# EAGLE schematic Antenna Schematic (EAGLE 9.6.2)
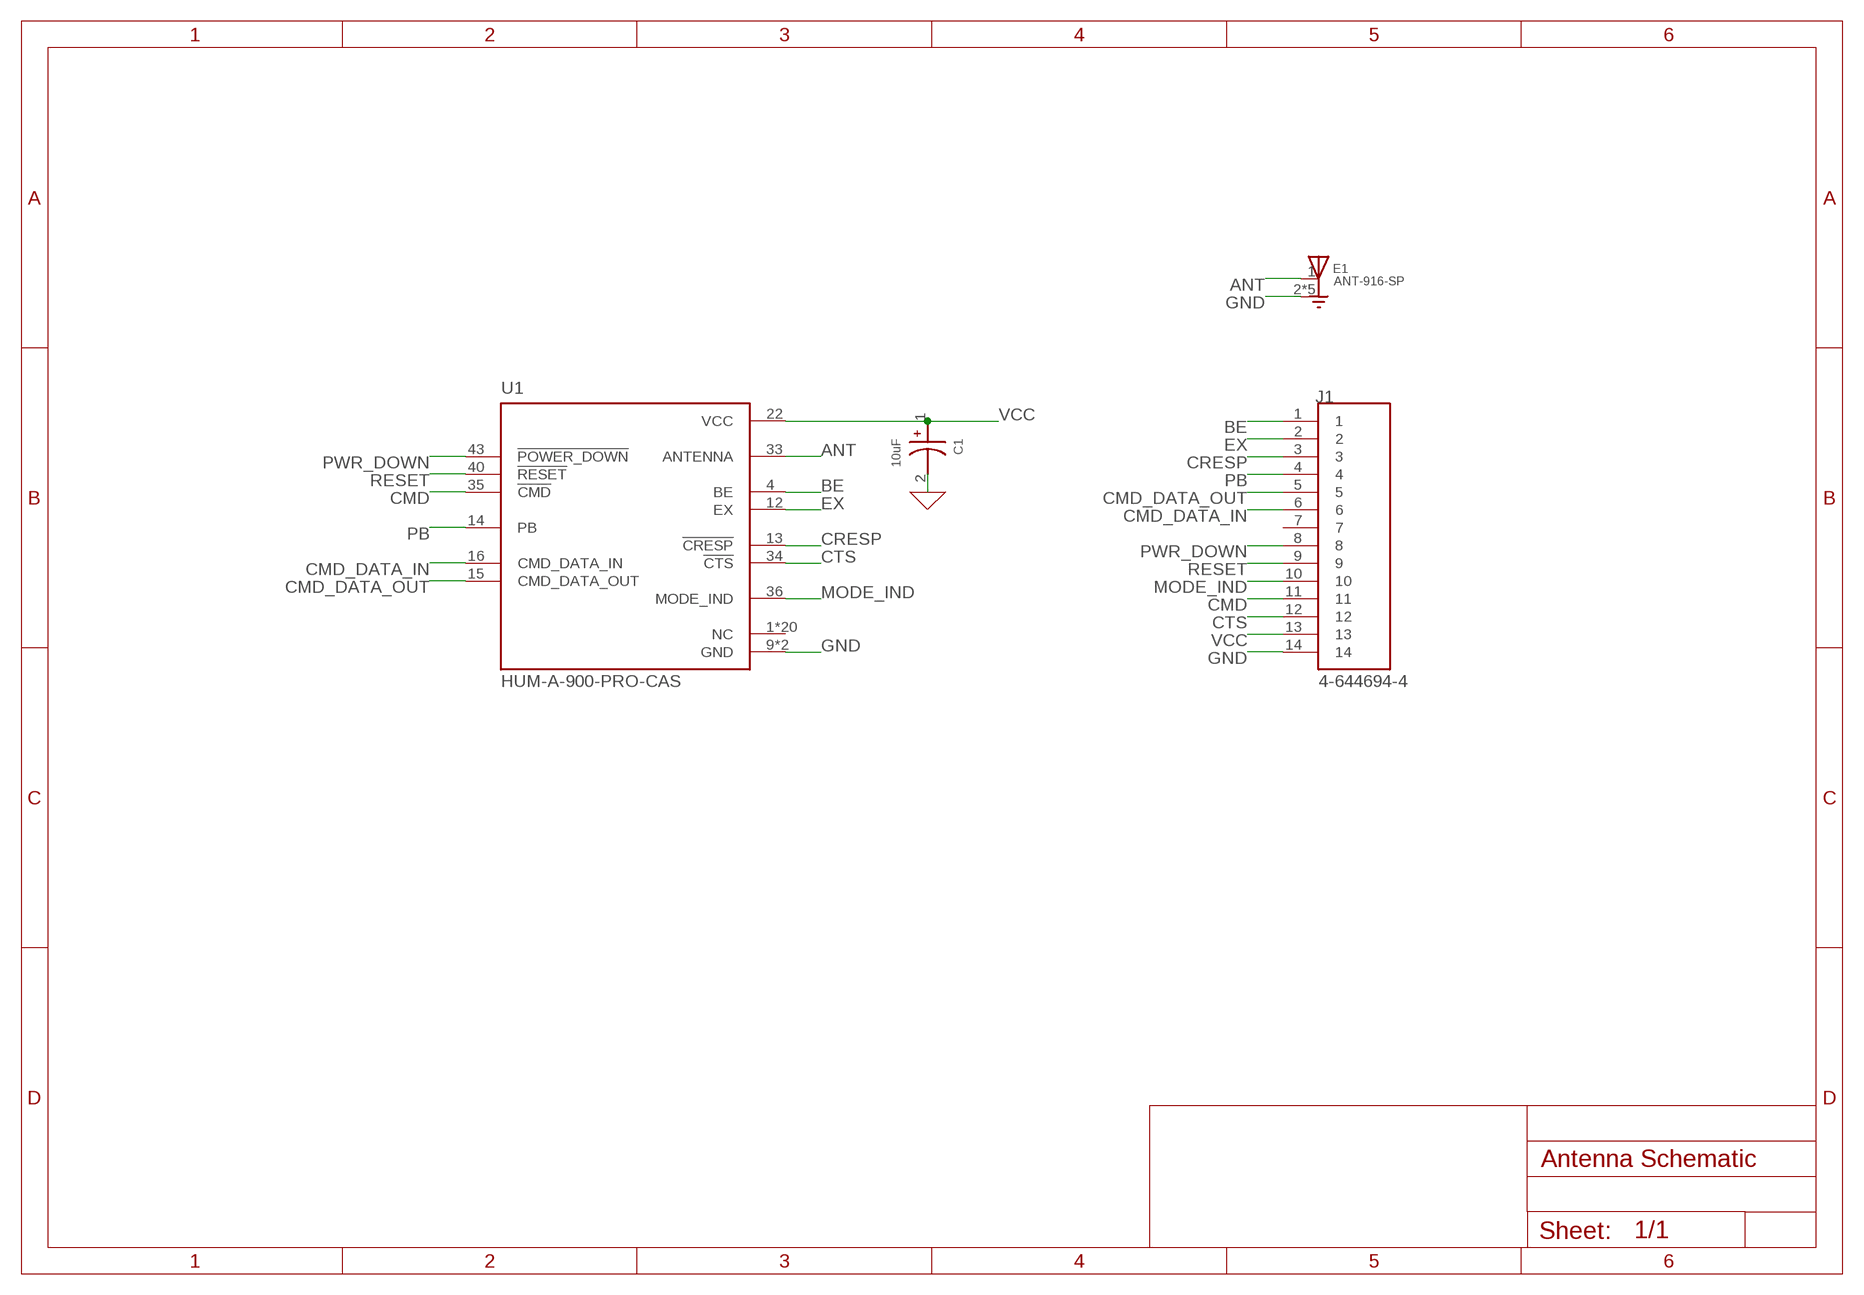
[diagram p0: schematic, sheet 1]

## Parts
C1  10uF  TAJA106K010RNJ  [CAPMP3216X180N]
E1  ANT-916-SP  [XDCR_ANT-916-SP]
J1  4-644694-4  [TE_4-644694-4]
U1  HUM-A-900-PRO-CAS  [XCVR_HUM-A-900-PRO-CAS]

## Nets
ANT: E1.1(FEEDING) U1.33(ANTENNA)
BE: J1.1 U1.4(BE)
CMD: J1.11 U1.35(!CMD)
CMD_DATA_IN: J1.6 U1.16(CMD_DATA_IN)
CMD_DATA_OUT: J1.5 U1.15(CMD_DATA_OUT)
CRESP: J1.3 U1.13(!CRESP)
CTS: J1.12 U1.34(!CTS)
EX: J1.2 U1.12(EX)
GND: C1.2 E1.2(GND) E1.3(GND) E1.4(GND) E1.5(GND) E1.6(GND) J1.14 U1.9(GND) U1.32(GND)
MODE_IND: J1.10 U1.36(MODE_IND)
PB: J1.4 U1.14(PB)
PWR_DOWN: J1.8 U1.43(!POWER_DOWN)
RESET: J1.9 U1.40(!RESET)
VCC: C1.1 J1.13 U1.22(VCC)
Unconnected: J1.7 U1.1(NC) U1.2(NC) U1.3(NC) U1.5(NC) U1.6(NC) U1.7(NC) U1.8(NC) U1.10(NC) U1.11(NC) U1.17(NC) U1.18(NC) U1.19(NC) U1.20(NC) U1.21(NC) U1.37(NC) U1.38(NC) U1.39(NC) U1.41(NC) U1.42(NC) U1.44(NC)

## Library data of the parts
C1 = TAJA106K010RNJ:TAJA106K010RNJ: 1µF Molded Tantalum Capacitors 16V 1206 (3216 Metric) 11Ohm @ 100kHz Check prices <https://pricing.snapeda.com/parts/TAJA106K010RNJ/AVX%20Interconnect%20/%20Elco/view-part?ref=eda>; AVAILABILITY: Warning; DESCRIPTION: 10µF Molded Tantalum Capacitors 10V 1206 (3216 Metric) 3Ohm; MF: AVX Interconnect / Elco; MP: TAJA106K010RNJ; PACKAGE: 1206 AVX; PRICE: None; PURCHASE-URL: https://pricing.snapeda.com/search/part/TAJA106K010RNJ/?ref=eda
E1 = ANT-916-SP:ANT-916-SP: 315MHz Alarms, ISM, Remote Control, Security Systems Chip RF Antenna 312MHz ~ 317MHz Solder Surface Mount Check prices <https://pricing.snapeda.com/parts/ANT-916-SP/Linx%20Technologies/view-part?ref=eda>; AVAILABILITY: Warning; DESCRIPTION: 915 MHz Monopole Chip Antenna; MF: Linx Technologies; MP: ANT-916-SP; PACKAGE: ANTENNA-1 Linx Technologies; PRICE: None; PURCHASE-URL: https://pricing.snapeda.com/search/part/ANT-916-SP/?ref=eda
J1 = 4-644694-4:4-644694-4: Check prices <https://pricing.snapeda.com/parts/4-644694-4/TE%20Connectivity/view-part?ref=eda>; AVAILABILITY: Good; CENTERLINE_PITCH: 2.54 mm[.1 in]; COMMENT: 4-644694-4; DESCRIPTION: 14P MTA100 R/A HDR RETENTIVE; EU_ROHS_COMPLIANCE: Compliant; MF: TE Connectivity; MP: 4-644694-4; NUMBER_OF_POSITIONS: 14; PACKAGE: None; PRICE: None; PRODUCT_TYPE: Connector; PURCHASE-URL: https://pricing.snapeda.com/search/part/4-644694-4/?ref=eda
U1 = HUM-A-900-PRO-CAS:HUM-A-900-PRO-CAS: General ISM < 1GHz Proprietary Transceiver Module 902MHz ~ 928MHz Antenna Not Included, Castellation Surface Mount Check prices <https://pricing.snapeda.com/parts/HUM-A-900-PRO-CAS/Linx/view-part?ref=eda>; AVAILABILITY: Warning; DESCRIPTION: General ISM < 1GHz Proprietary Transceiver Module 902MHz ~ 928MHz Antenna Not Included, Castellation Surface Mount; MF: Linx; MP: HUM-A-900-PRO-CAS; PACKAGE: Module Linx; PRICE: None; PURCHASE-URL: https://pricing.snapeda.com/search/part/HUM-A-900-PRO-CAS/?ref=eda